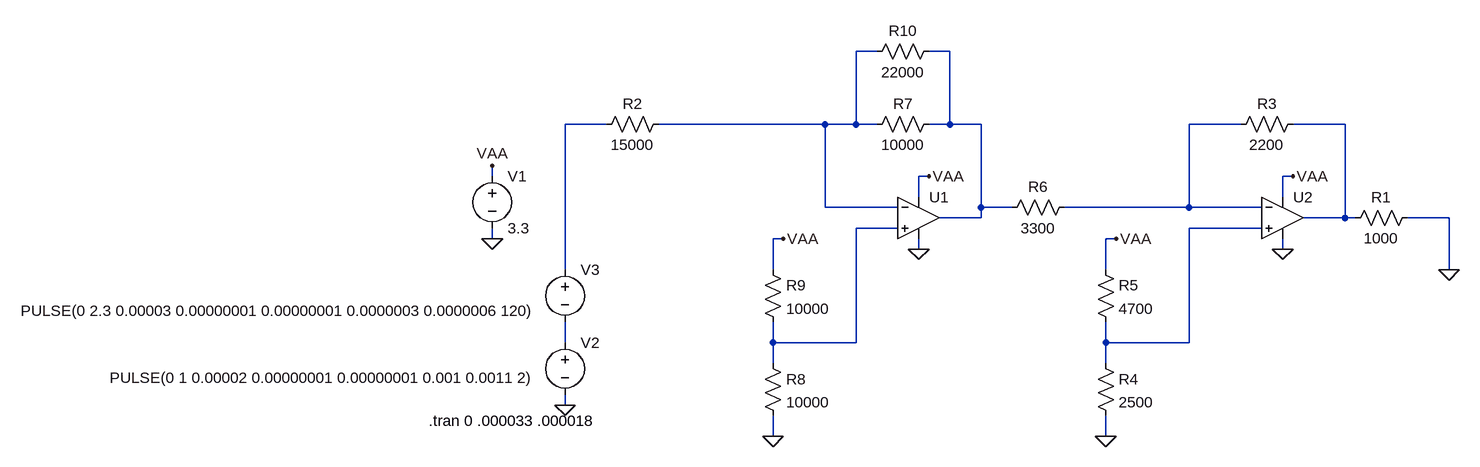
[diagram p0: schematic basic.asc]
basic.asc, the LTspice schematic file:
Version 4
SHEET 1 1588 680
WIRE 304 -80 272 -80
WIRE 416 -80 384 -80
WIRE -112 32 -176 32
WIRE 224 32 -32 32
WIRE 272 32 272 -80
WIRE 272 32 224 32
WIRE 304 32 272 32
WIRE 416 32 416 -80
WIRE 416 32 384 32
WIRE 464 32 416 32
WIRE 864 32 784 32
WIRE 1024 32 944 32
WIRE -288 112 -288 96
WIRE 384 112 368 112
WIRE 944 112 928 112
WIRE 368 144 368 112
WIRE 928 144 928 112
WIRE 224 160 224 32
WIRE 336 160 224 160
WIRE 464 160 464 32
WIRE 512 160 464 160
WIRE 784 160 784 32
WIRE 784 160 592 160
WIRE 896 160 784 160
WIRE 464 176 464 160
WIRE 464 176 400 176
WIRE 1024 176 1024 32
WIRE 1024 176 960 176
WIRE 1040 176 1024 176
WIRE 1184 176 1120 176
WIRE 336 192 272 192
WIRE 896 192 784 192
WIRE -288 208 -288 192
WIRE 160 208 144 208
WIRE 672 208 656 208
WIRE 368 224 368 208
WIRE 928 224 928 208
WIRE -176 256 -176 32
WIRE 144 256 144 208
WIRE 656 256 656 208
WIRE 1184 256 1184 176
WIRE -176 368 -176 336
WIRE 144 368 144 336
WIRE 272 368 272 192
WIRE 272 368 144 368
WIRE 656 368 656 336
WIRE 784 368 784 192
WIRE 784 368 656 368
WIRE 144 400 144 368
WIRE 656 400 656 368
WIRE -176 464 -176 448
WIRE 144 512 144 480
WIRE 656 512 656 480
FLAG -288 208 0
FLAG -176 464 0
FLAG 928 224 0
FLAG 944 112 VAA
FLAG -288 96 VAA
FLAG 1184 256 0
FLAG 368 224 0
FLAG 384 112 VAA
FLAG 144 512 0
FLAG 160 208 VAA
FLAG 656 512 0
FLAG 672 208 VAA
SYMBOL voltage -288 96 R0
WINDOW 123 0 0 Left 0
WINDOW 39 0 0 Left 0
SYMATTR InstName V1
SYMATTR Value 3.3
SYMBOL voltage -176 352 R0
WINDOW 3 -39 70 Right 2
WINDOW 123 0 0 Left 0
WINDOW 39 0 0 Left 0
SYMATTR InstName V2
SYMATTR Value PULSE(0 1 0.00002 0.00000001 0.00000001 0.001 0.0011 2)
SYMBOL res 1136 160 R90
WINDOW 0 0 56 VBottom 2
WINDOW 3 32 56 VTop 2
SYMATTR InstName R1
SYMATTR Value 1000
SYMBOL voltage -176 240 R0
WINDOW 3 -34 79 Right 2
WINDOW 123 0 0 Left 0
WINDOW 39 0 0 Left 0
SYMATTR InstName V3
SYMATTR Value PULSE(0 2.3 0.00003 0.00000001 0.00000001 0.0000003 0.0000006 120)
SYMBOL Opamps\\UniversalOpamp2 928 176 R0
SYMATTR InstName U2
SYMATTR Value2 Avol=1Meg GBW=20Meg Slew=20Meg
SYMBOL res -16 16 R90
WINDOW 0 0 56 VBottom 2
WINDOW 3 32 56 VTop 2
SYMATTR InstName R2
SYMATTR Value 15000
SYMBOL res 960 16 R90
WINDOW 0 0 56 VBottom 2
WINDOW 3 32 56 VTop 2
SYMATTR InstName R3
SYMATTR Value 2200
SYMBOL res 608 144 R90
WINDOW 0 0 56 VBottom 2
WINDOW 3 32 56 VTop 2
SYMATTR InstName R6
SYMATTR Value 3300
SYMBOL Opamps\\UniversalOpamp2 368 176 R0
SYMATTR InstName U1
SYMATTR Value2 Avol=1Meg GBW=20Meg Slew=20Meg
SYMBOL res 400 16 R90
WINDOW 0 0 56 VBottom 2
WINDOW 3 32 56 VTop 2
SYMATTR InstName R7
SYMATTR Value 10000
SYMBOL res 128 384 R0
SYMATTR InstName R8
SYMATTR Value 10000
SYMBOL res 128 240 R0
SYMATTR InstName R9
SYMATTR Value 10000
SYMBOL res 640 384 R0
SYMATTR InstName R4
SYMATTR Value 2500
SYMBOL res 640 240 R0
SYMATTR InstName R5
SYMATTR Value 4700
SYMBOL res 288 -64 R270
WINDOW 0 32 56 VTop 2
WINDOW 3 0 56 VBottom 2
SYMATTR InstName R10
SYMATTR Value 22000
TEXT -386 488 Left 2 !.tran 0 .000033 .000018

The netlist it stands for:
* basic.asc
V1 VAA 0 3.3
V2 N008 0 PULSE(0 1 0.00002 0.00000001 0.00000001 0.001 0.0011 2)
R1 0 N005 1000
V3 N003 N008 PULSE(0 2.3 0.00003 0.00000001 0.00000001 0.0000003 0.0000006 120)
XU2 N007 N004 VAA 0 N005 level.2 Avol=1Meg GBW=20Meg Slew=20Meg ilimit=25m rail=0 Vos=0 phimargin=45 en=0 enk=0 in=0 ink=0 Rin=500Meg  ; pins IN+ IN- V+ V- OUT
R2 N001 N003 15000
R3 N005 N004 2200
R6 N004 N002 3300
XU1 N006 N001 VAA 0 N002 level.2 Avol=1Meg GBW=20Meg Slew=20Meg ilimit=25m rail=0 Vos=0 phimargin=45 en=0 enk=0 in=0 ink=0 Rin=500Meg  ; pins IN+ IN- V+ V- OUT
R7 N002 N001 10000
R8 N006 0 10000
R9 VAA N006 10000
R4 N007 0 2500
R5 VAA N007 4700
R10 N001 N002 22000
.tran 0 .000033 .000018
.lib UniversalOpamps2.sub
.backanno
.end